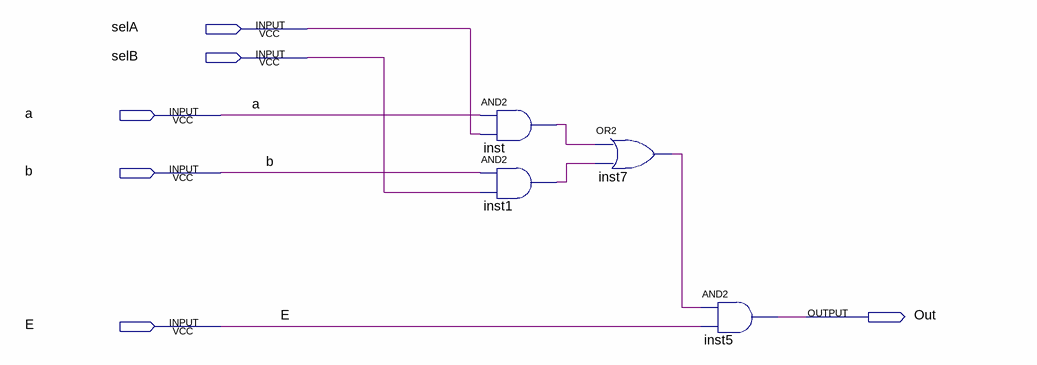
[diagram p0: schematic sheet]
// Quartus schematic MUX.bdf as structural Verilog: 4 symbols, 6 pins
module MUX (
  input  selA,
  input  selB,
  input  a,
  input  b,
  input  E,
  output Out
);

  wire inst1_out, inst7_out, inst_out;

  and inst (inst_out, a, selA);
  and inst1 (inst1_out, b, selB);
  or inst7 (inst7_out, inst_out, inst1_out);
  and inst5 (Out, inst7_out, E);
endmodule
